# EAGLE design freiBot (EAGLE 7.5.0)
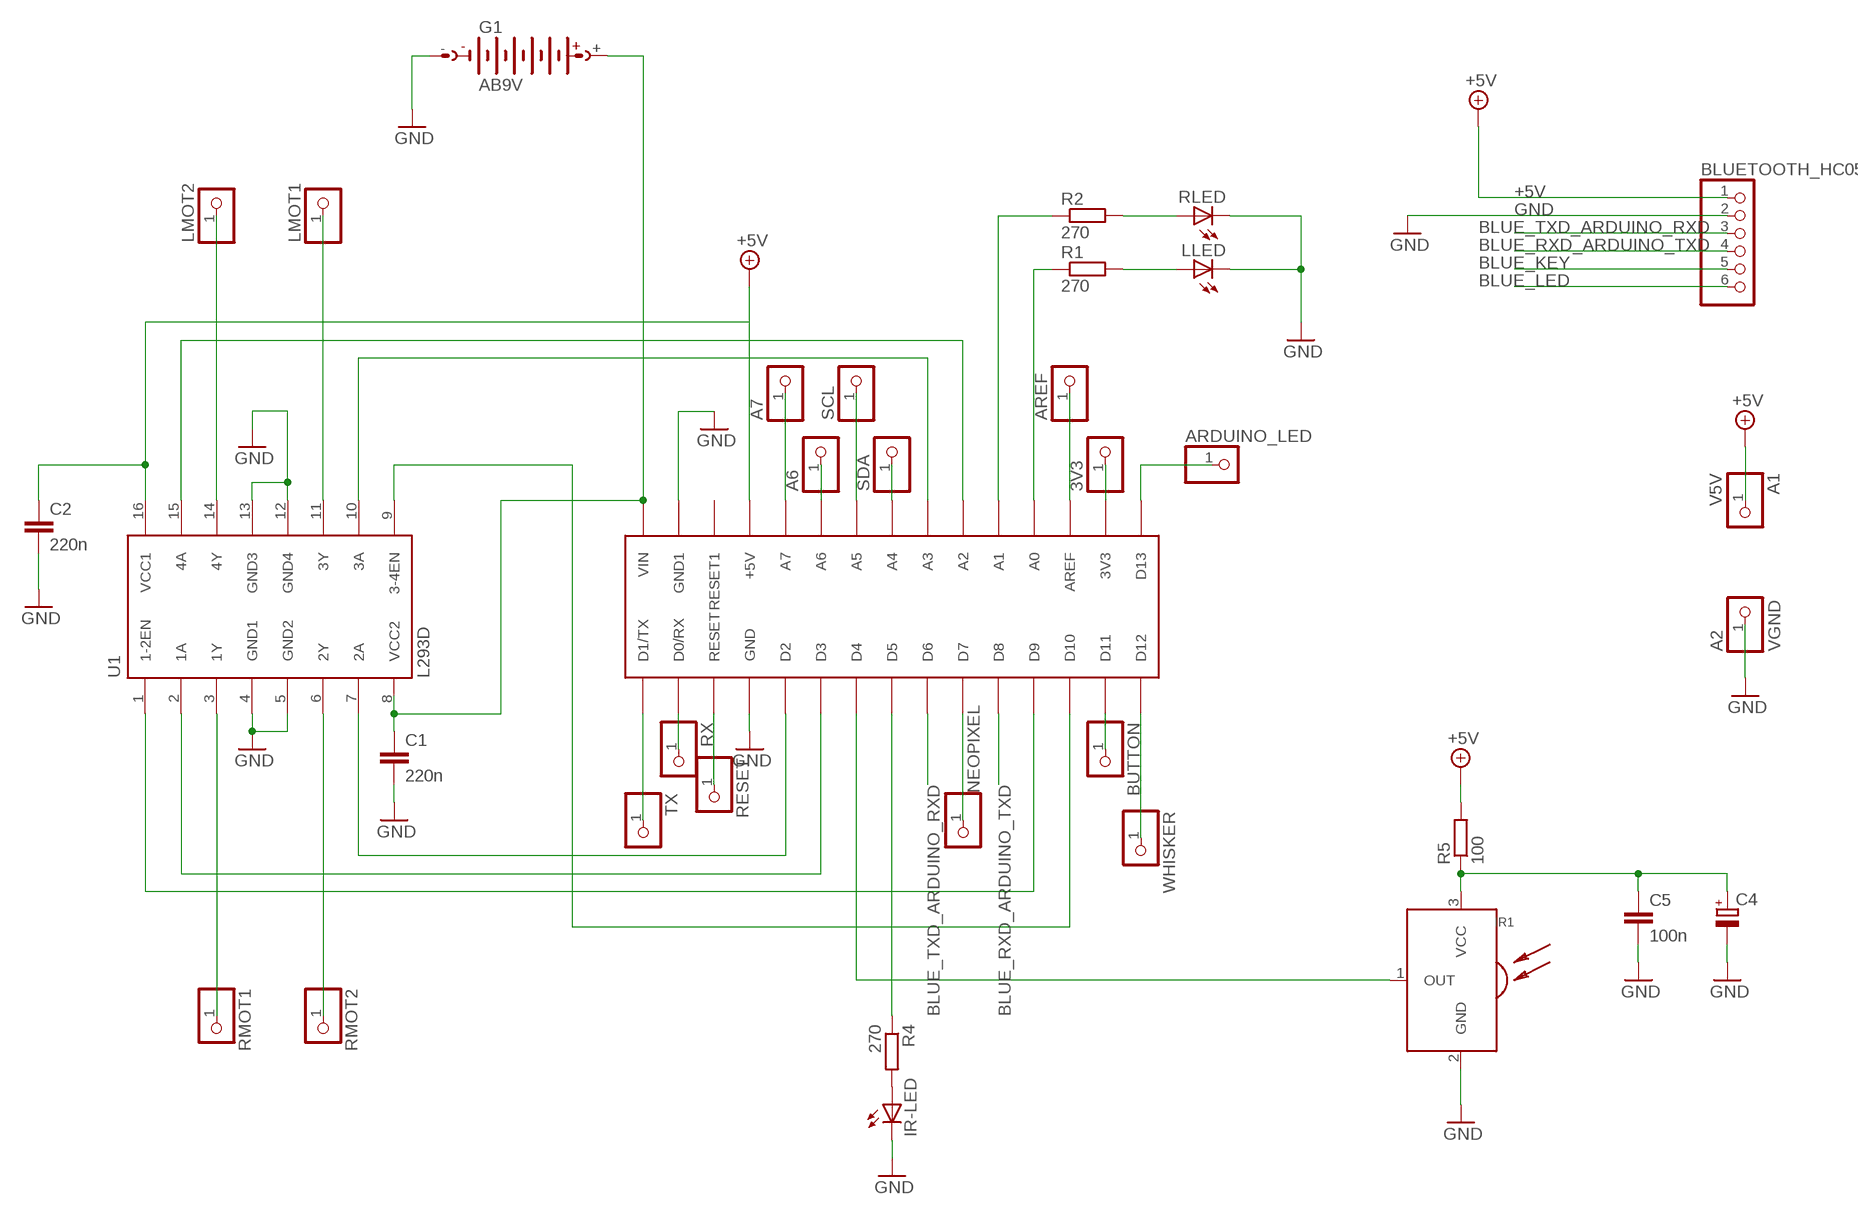
[diagram p0: schematic, sheet 1]

## Parts
3V3  PINHD-1X1  [1X01]
A1  V5V  PINHD-1X1  [1X01]
A2  VGND  PINHD-1X1  [1X01]
A6  PINHD-1X1  [1X01]
A7  PINHD-1X1  [1X01]
ARDUINO_LED  PINHD-1X1  [1X01]
AREF  PINHD-1X1  [1X01]
BLUETOOTH_HC05  PINHD-1X6  [1X06]
BUTTON  PINHD-1X1  [1X01]
C1  220n  C-EU075-042X103  [C075-042X103]
C2  220n  C-EU075-042X103  [C075-042X103]
C4  CPOL-EUE5-8.5  [E5-8,5]
C5  100n  C-EU050-025X075  [C050-025X075]
G1  AB9V  [AB9V]
IR1  SFH5110  [SFH511*]
IR-LED  LED5MM  [LED5MM]
LLED  LED10MM  [LED10MM]
LMOT1  PINHD-1X1  [1X01]
LMOT2  PINHD-1X1  [1X01]
NEOPIXEL  PINHD-1X1  [1X01]
R1  270  R-EU_0309/12  [0309/12]
R2  270  R-EU_0309/12  [0309/12]
R4  270  R-EU_0309/12  [0309/12]
R5  100  R-EU_0309/10  [0309/10]
RESET  PINHD-1X1  [1X01]
RLED  LED10MM  [LED10MM]
RMOT1  PINHD-1X1  [1X01]
RMOT2  PINHD-1X1  [1X01]
RX  PINHD-1X1  [1X01]
SCL  PINHD-1X1  [1X01]
SDA  PINHD-1X1  [1X01]
TX  PINHD-1X1  [1X01]
U1  L293D  [DIL16]
U2  ARDUINONANO  [PDIP-32]
WHISKER  PINHD-1X1  [1X01]

## Nets
+5V: A1.1 BLUETOOTH_HC05.1 C2.1 R5.2 U1.16(VCC1) U2.+5V
BLUE_KEY: BLUETOOTH_HC05.5
BLUE_LED: BLUETOOTH_HC05.6
BLUE_RXD_ARDUINO_TXD: BLUETOOTH_HC05.4 U2.D8
BLUE_TXD_ARDUINO_RXD: BLUETOOTH_HC05.3 U2.D6
GND: A2.1 BLUETOOTH_HC05.2 C1.2 C2.2 C4.- C5.2 G1.- IR1.2(GND) IR-LED.K(C) LLED.K(C) RLED.K(C) U1.4(GND1) U1.5(GND2) U1.12(GND4) U1.13(GND3) U2.GND U2.GND1
N$1: U1.7(2A) U2.D2
N$2: U1.2(1A) U2.D3
N$3: U1.1(1-2EN) U2.D9
N$4: RMOT1.1 U1.3(1Y)
N$5: U1.9(3-4EN) U2.D10
N$6: U1.10(3A) U2.A3
N$7: U1.15(4A) U2.A2
N$8: RMOT2.1 U1.6(2Y)
N$9: LMOT1.1 U1.11(3Y)
N$10: LMOT2.1 U1.14(4Y)
N$11: C1.1 G1.+ U1.8(VCC2) U2.VIN
N$12: IR-LED.A R4.2
N$13: R1.1 U2.A0
N$14: R2.1 U2.A1
N$15: R2.2 RLED.A
N$16: LLED.A R1.2
N$17: SDA.1 U2.A4
N$18: SCL.1 U2.A5
N$19: ARDUINO_LED.1 U2.D13
N$20: U2.D12 WHISKER.1
N$21: BUTTON.1 U2.D11
N$22: NEOPIXEL.1 U2.D7
N$23: IR1.1(OUT) U2.D4
N$24: R4.1 U2.D5
N$25: A6.1 U2.A6
N$26: 3V3.1 U2.3V3
N$27: AREF.1 U2.AREF
N$28: A7.1 U2.A7
N$29: RESET.1 U2.RESET
N$30: TX.1 U2.D1/TX
N$31: RX.1 U2.D0/RX
VCC: C4.+ C5.1 IR1.3(VCC) R5.1
Unconnected: U2.RESET1

## Library data of the parts
3V3 A1 A2 A6 A7 ARDUINO_LED AREF BUTTON LMOT1 LMOT2 NEOPIXEL RESET RMOT1 RMOT2 RX SCL SDA TX WHISKER = pinhead:PINHD-1X1: PIN HEADER
BLUETOOTH_HC05 = pinhead:PINHD-1X6: PIN HEADER
C1 C2 C5 = rcl:C-EU: CAPACITOR, European symbol
C4 = rcl:CPOL-EU: POLARIZED CAPACITOR, European symbol
G1 = battery:AB9V: 9-V BATTERY CLIP
IR1 = 0-svo:SFH511*: SFH 5110 and SFH 5111 are IR receivers to detect light from infrared remote control systems. The IC includes photodiode, preamplifier, automatic gain control, bandpass and demodulator. The black-colored package is designed as daylight- cutoff filter.
IR-LED = 0-svo:LED: LED
LLED RLED = led:LED: LED
R1 R2 R4 R5 = rcl:R-EU_: RESISTOR, European symbol
U1 = st-microelectronics:L293D: PUSH-PULL 4 CHANNEL DRIVER; MPN: L293D; OC_FARNELL: 9589619; OC_NEWARK: 56P8249
U2 = jet-lib:ARDUINONANO

## Board
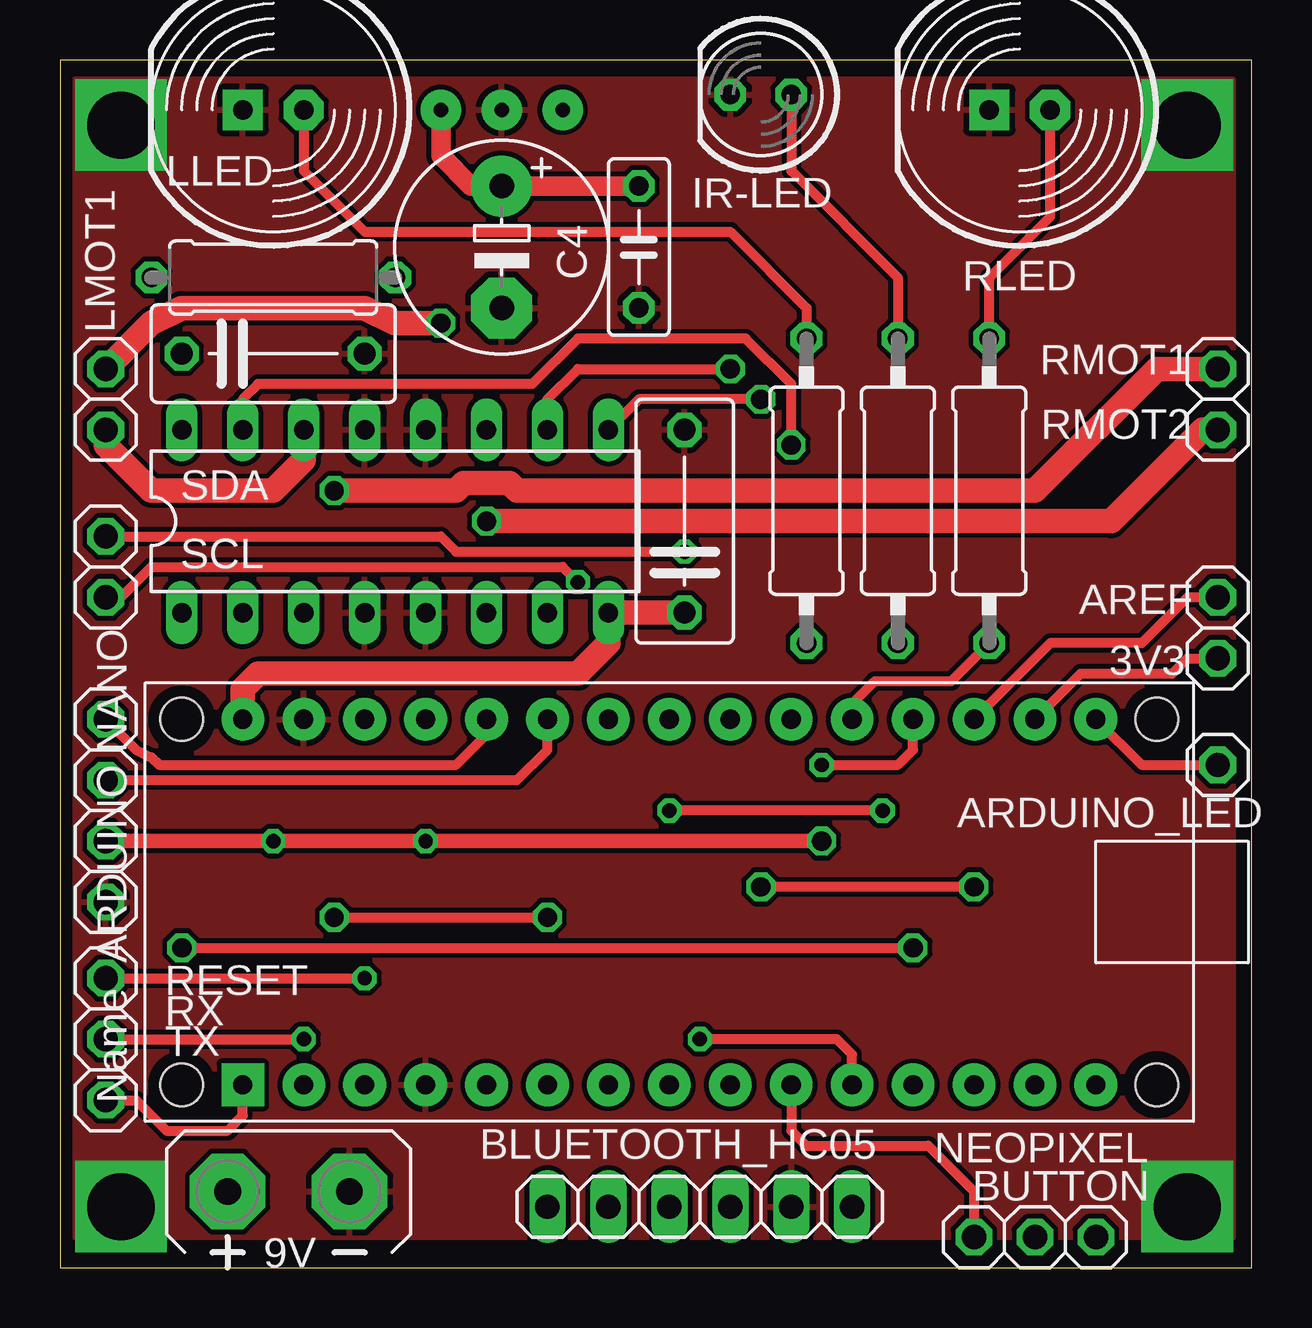
[diagram p1: board, top side]
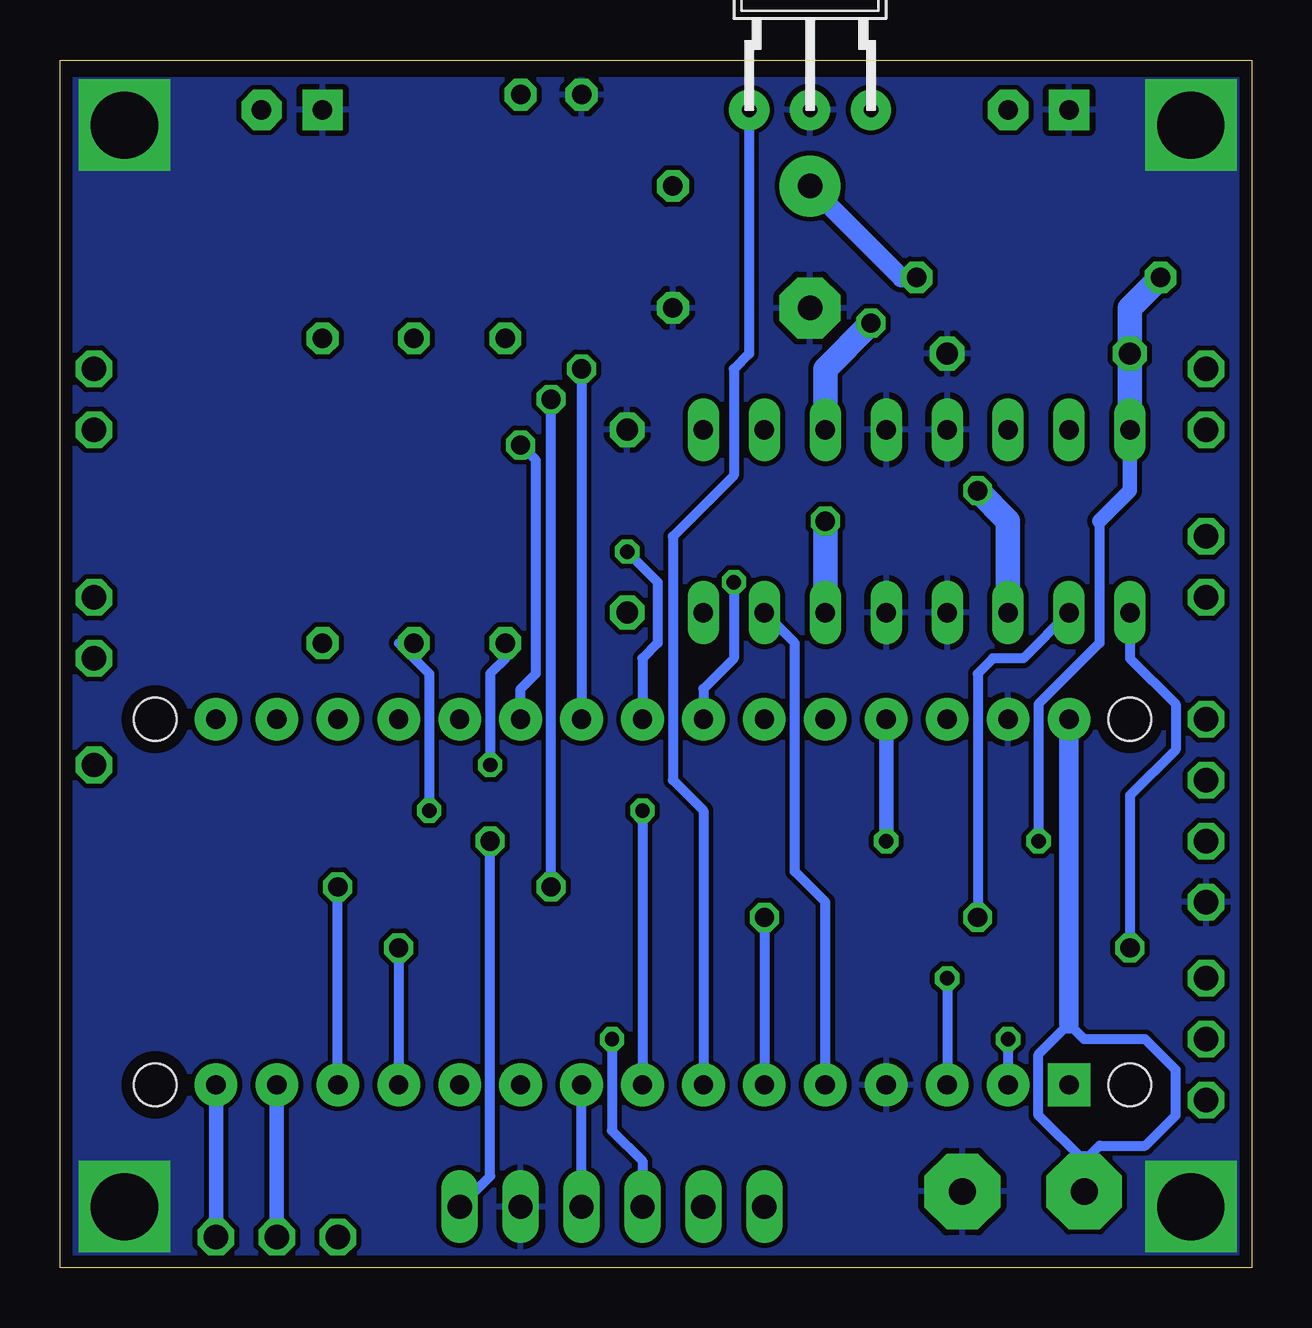
[diagram p2: board, bottom side, seen from below]

Size 49.68 x 50.34 mm. Coordinates in mm from the lower left corner, seen from the top.
Outline: 0,0 49.68,0 49.68,50.34 0,50.34 0,0
Copper layers (1*16): Top 0.035mm / dielectric 1.5mm / Bottom 0.035mm
Design rules "default *": minimum track width 0.4mm, minimum drill 0.6mm, track to track 8mil, track to pad 6mil, pad to pad 8mil, via to via 8mil, smd to smd 8mil, copper to edge 20mil, drill to drill 8mil, minimum pad ring 10mil, minimum via ring 8mil, stop-mask expansion 4mil, vias tented up to drill 0mil, thermal gap 10mil

### Footprints (pad centres in the part's own frame; a part is rotated, then mirrored left to right if it is on the bottom)
1X01 = drill 1.016 octagon: 1 0,0
1X06 = drill 1.016 long: 1 -6.35,0; 2 -3.81,0; 3 -1.27,0; 4 1.27,0; 5 3.81,0; 6 6.35,0
C075-042X103 = drill 0.914 octagon: 1 -3.81,0; 2 3.81,0
E5-8,5 = drill 1.016 pad 2.54: + -2.54,0 | drill 1.016 pad 2.54 octagon: - 2.54,0
C050-025X075 = drill 0.813 octagon: 1 -2.54,0; 2 2.54,0
AB9V = drill 1.118 pad 3.15 octagon: + 0,2.54; - 0,-2.54
SFH511* = drill 0.61 pad 1.676: 1 -2.54,0; 2 0,0; 3 2.54,0
LED5MM = drill 0.813 octagon: A -1.27,0; K 1.27,0
LED10MM = drill 0.813 pad 1.676 octagon: A -1.27,0 | drill 0.813 pad 1.676 square: K 1.27,0
0309/12 = drill 0.813 octagon: 1 -6.35,0; 2 6.35,0
0309/10 = drill 0.813 octagon: 1 -5.08,0; 2 5.08,0
DIL16 = drill 0.813 long: 1 -8.89,-3.81; 2 -6.35,-3.81; 3 -3.81,-3.81; 4 -1.27,-3.81; 5 1.27,-3.81; 6 3.81,-3.81; 7 6.35,-3.81; 8 8.89,-3.81; 9 8.89,3.81; 10 6.35,3.81; 11 3.81,3.81; 12 1.27,3.81; 13 -1.27,3.81; 14 -3.81,3.81; 15 -6.35,3.81; 16 -8.89,3.81
PDIP-32 = drill 0.8 pad 1.778: 3V3 15.24,-35.56; +5V 15.24,-10.16; A0 15.24,-30.48; A1 15.24,-27.94; A2 15.24,-25.4; A3 15.24,-22.86; A4 15.24,-20.32; A5 15.24,-17.78; A6 15.24,-15.24; A7 15.24,-12.7; AREF 15.24,-33.02; D0/RX 0,-5.08; D2 0,-12.7; D3 0,-15.24; D4 0,-17.78; D5 0,-20.32; D6 0,-22.86; D7 0,-25.4; D8 0,-27.94; D9 0,-30.48; D10 0,-33.02; D11 0,-35.56; D12 0,-38.1; D13 15.24,-38.1; GND 0,-10.16; GND1 15.24,-5.08; RESET 0,-7.62; RESET1 15.24,-7.62; VIN 15.24,-2.54 | drill 0.8 pad 1.778 square: D1/TX 0,-2.54 | hole 1.778: 0,0; 0,-40.64; 15.24,-40.64; 15.24,0

### Placement (x,y rotation side)
3V3  48.26,25.4 0 top
A1  1.91,17.78 0 top
A2  1.91,15.24 0 top
A6  1.91,20.32 0 top
A7  1.91,22.86 0 top
ARDUINO_LED  48.26,20.95 0 top
AREF  48.26,27.94 0 top
BLUETOOTH_HC05  26.67,2.54 180 top
BUTTON  40.64,1.27 0 top
C1  26.04,31.11 90 top
C2  8.89,38.1 0 top
C4  18.41,42.55 270 top
C5  24.13,42.55 270 top
G1  9.53,3.17 90 top
IR1  18.41,48.26 0 bottom
IR-LED  29.21,48.9 180 top
LLED  8.89,48.26 180 top
LMOT1  1.91,37.47 0 top
LMOT2  1.91,34.92 0 top
NEOPIXEL  38.1,1.27 0 top
R1  31.11,32.38 90 top
R2  38.73,32.38 90 top
R4  34.92,32.38 90 top
R5  8.89,41.27 180 top
RESET  1.91,12.06 0 top
RLED  40.01,48.26 180 top
RMOT1  48.26,37.47 0 top
RMOT2  48.26,34.92 0 top
RX  1.91,9.53 0 top
SCL  1.91,27.94 0 top
SDA  1.91,30.48 0 top
TX  1.91,6.99 0 top
U1  13.97,31.11 0 top
U2  5.08,7.62 90 top
WHISKER  43.18,1.27 0 top

### Tracks (layer width: path | path; a pad name or v marks a point on that pad's centre or on a via)
+5V  (via drill 0.6, 0.8)
  Top 0.61: A1.1 v8.89,17.78 v15.24,17.78 v31.75,17.78
  Bottom 0.406: BLUETOOTH_HC05.1 31.75,3.81 v31.75,17.78 | 6.35,31.11 6.35,26.04 8.89,23.5 v8.89,17.78
  Bottom 0.61: v15.24,17.78 U2.+5V | U1.16 5.08,32.38 6.35,31.11
  Bottom 1.016: U1.16 C2.1 5.08,40.01 R5.2
BLUE_RXD_ARDUINO_TXD  (via drill 0.6)
  Top 0.406: U2.D8 33.02,8.89 32.38,9.53 v26.67,9.53
  Bottom 0.406: v26.67,9.53 26.67,5.71 25.4,4.45 BLUETOOTH_HC05.4
BLUE_TXD_ARDUINO_RXD
  Bottom 0.406: BLUETOOTH_HC05.3 U2.D6
GND  (via drill 2.8)
  other vias: 2.54,2.54 46.99,2.54 46.99,47.62 2.54,47.62
  pour Bottom: 0.5,49.5 49.5,49.5 49.5,0.5 0.5,0.5 0.5,1
  pour Top: 0.64,49.53 48.9,49.53 48.9,1.27 0.64,1.27
N$1
  Bottom 0.406: U2.D2 17.78,15.24 19.05,16.51 19.05,26.04 U1.7
N$2  (via drill 0.8)
  Top 0.406: v11.43,14.61 v20.32,14.61
  Bottom 0.406: U1.2 9.53,25.4 10.79,25.4 11.43,24.77 v11.43,14.61 | v20.32,14.61 U2.D3
N$3  (via drill 0.8)
  Top 0.406: v5.08,13.34 v35.56,13.34
  Bottom 0.406: U1.1 5.08,25.4 3.17,23.5 3.17,21.59 5.08,19.68 v5.08,13.34 | v35.56,13.34 U2.D9
N$4  (via drill 0.8)
  Top 1.016: v11.43,32.38 16.51,32.38 16.83,32.7 18.73,32.7 19.05,32.38 40.64,32.38 45.72,37.47 RMOT1.1
  Bottom 1.016: U1.3 10.16,31.11 v11.43,32.38
N$5  (via drill 0.8)
  Top 0.406: v38.1,15.88 v29.21,15.88 | v29.21,36.2 24.13,36.2 U1.9
  Bottom 0.406: U2.D10 v38.1,15.88 | v29.21,15.88 v29.21,36.2
N$6  (via drill 0.8)
  Top 0.406: U1.10 20.32,36.2 21.59,37.47 v27.94,37.47
  Bottom 0.406: v27.94,37.47 U2.A3
N$7  (via drill 0.8)
  Top 0.406: v30.48,34.29 30.48,36.83 28.57,38.73 21.59,38.73 19.68,36.83 8.26,36.83 7.62,36.2 U1.15
  Bottom 0.406: U2.A2 30.48,24.13 29.84,24.77 29.84,33.66 v30.48,34.29
N$8  (via drill 0.8)
  Top 1.016: RMOT2.1 47.62,34.92 43.81,31.11 v17.78,31.11
  Bottom 1.016: v17.78,31.11 U1.6
N$9  (via drill 0.8)
  Top 1.016: LMOT1.1 3.81,39.37 5.08,40.01 12.7,40.01 13.97,39.37 v15.88,39.37
  Bottom 1.016: U1.11 17.78,37.47 v15.88,39.37
N$10
  Top 1.016: LMOT2.1 1.91,34.29 3.81,32.38 8.89,32.38 10.16,33.66 U1.14
N$11
  Top 1.016: C1.1 U1.8 22.86,26.04 21.59,24.77 8.26,24.77 7.62,24.13 U2.VIN
  Bottom 0.406: 6.99,4.45 6.35,5.08 4.45,5.08 3.17,6.35 3.17,8.26 4.45,9.53 6.99,9.53 7.62,10.16 8.89,8.89 8.89,6.35 6.99,4.45
  Bottom 0.813: G1.+ 6.99,4.45 | 7.62,10.16 U2.VIN
N$12
  Top 0.406: IR-LED.A 30.48,45.72 34.92,41.27 R4.2
N$13  (via drill 0.6)
  Top 0.406: v31.75,20.95 34.92,20.95 35.56,21.59 U2.A0
  Bottom 0.406: R1.1 31.11,25.4 31.75,24.77 v31.75,20.95
N$14
  Top 0.406: U2.A1 33.02,23.5 33.97,24.45 37.15,24.45 R2.1
N$15
  Top 0.406: R2.2 38.73,41.27 41.27,43.81 RLED.A
N$16
  Top 0.406: LLED.A 10.16,45.72 12.7,43.18 27.94,43.18 31.11,40.01 R1.2
N$17  (via drill 0.6)
  Top 0.406: SDA.1 15.88,30.48 16.51,29.84 v26.04,29.84
  Bottom 0.406: v26.04,29.84 24.77,28.57 24.77,26.04 25.4,25.4 U2.A4
N$18  (via drill 0.6)
  Top 0.406: SCL.1 2.54,27.94 3.81,29.21 20.95,29.21 v21.59,28.57
  Bottom 0.406: v21.59,28.57 21.59,25.4 22.86,24.13 U2.A5
N$19
  Top 0.406: U2.D13 45.09,20.95 ARDUINO_LED.1
N$20
  Bottom 0.61: U2.D12 WHISKER.1
N$21
  Bottom 0.61: U2.D11 BUTTON.1
N$22
  Top 0.406: U2.D7 30.48,5.71 31.11,5.08 36.2,5.08 38.1,3.17 NEOPIXEL.1
N$23
  Bottom 0.406: IR1.1 20.95,38.1 21.59,37.47 21.59,33.02 24.13,30.48 24.13,20.32 22.86,19.05 U2.D4
N$24  (via drill 0.6)
  Top 0.406: v34.29,19.05 v25.4,19.05
  Bottom 0.406: R4.1 35.56,26.04 34.29,24.77 v34.29,19.05 | v25.4,19.05 U2.D5
N$25
  Top 0.406: A6.1 19.05,20.32 20.32,21.59 U2.A6
N$26
  Top 0.406: U2.3V3 42.55,24.77 46.35,24.77 46.99,25.4 3V3.1
N$27
  Top 0.406: AREF.1 46.99,27.94 45.09,26.04 41.27,26.04 U2.AREF
N$28
  Top 0.406: A7.1 3.17,21.59 3.81,21.27 4.13,20.95 16.51,20.95 17.78,22.23 U2.A7
N$29  (via drill 0.6)
  Top 0.406: RESET.1 v12.7,12.06
  Bottom 0.406: v12.7,12.06 U2.RESET
N$30
  Top 0.406: TX.1 3.17,6.99 4.45,5.71 6.99,5.71 7.62,6.35 U2.D1/TX
N$31  (via drill 0.6)
  Top 0.406: RX.1 v10.16,9.53
  Bottom 0.406: v10.16,9.53 U2.D0/RX
VCC
  Top 0.813: C5.1 C4.+ 17.14,45.09 15.88,46.35 IR1.3
  Bottom 0.813: R5.1 14.61,41.27 C4.+